# EAGLE schematic 9.1.2.1_detector (EAGLE 9.6.2)
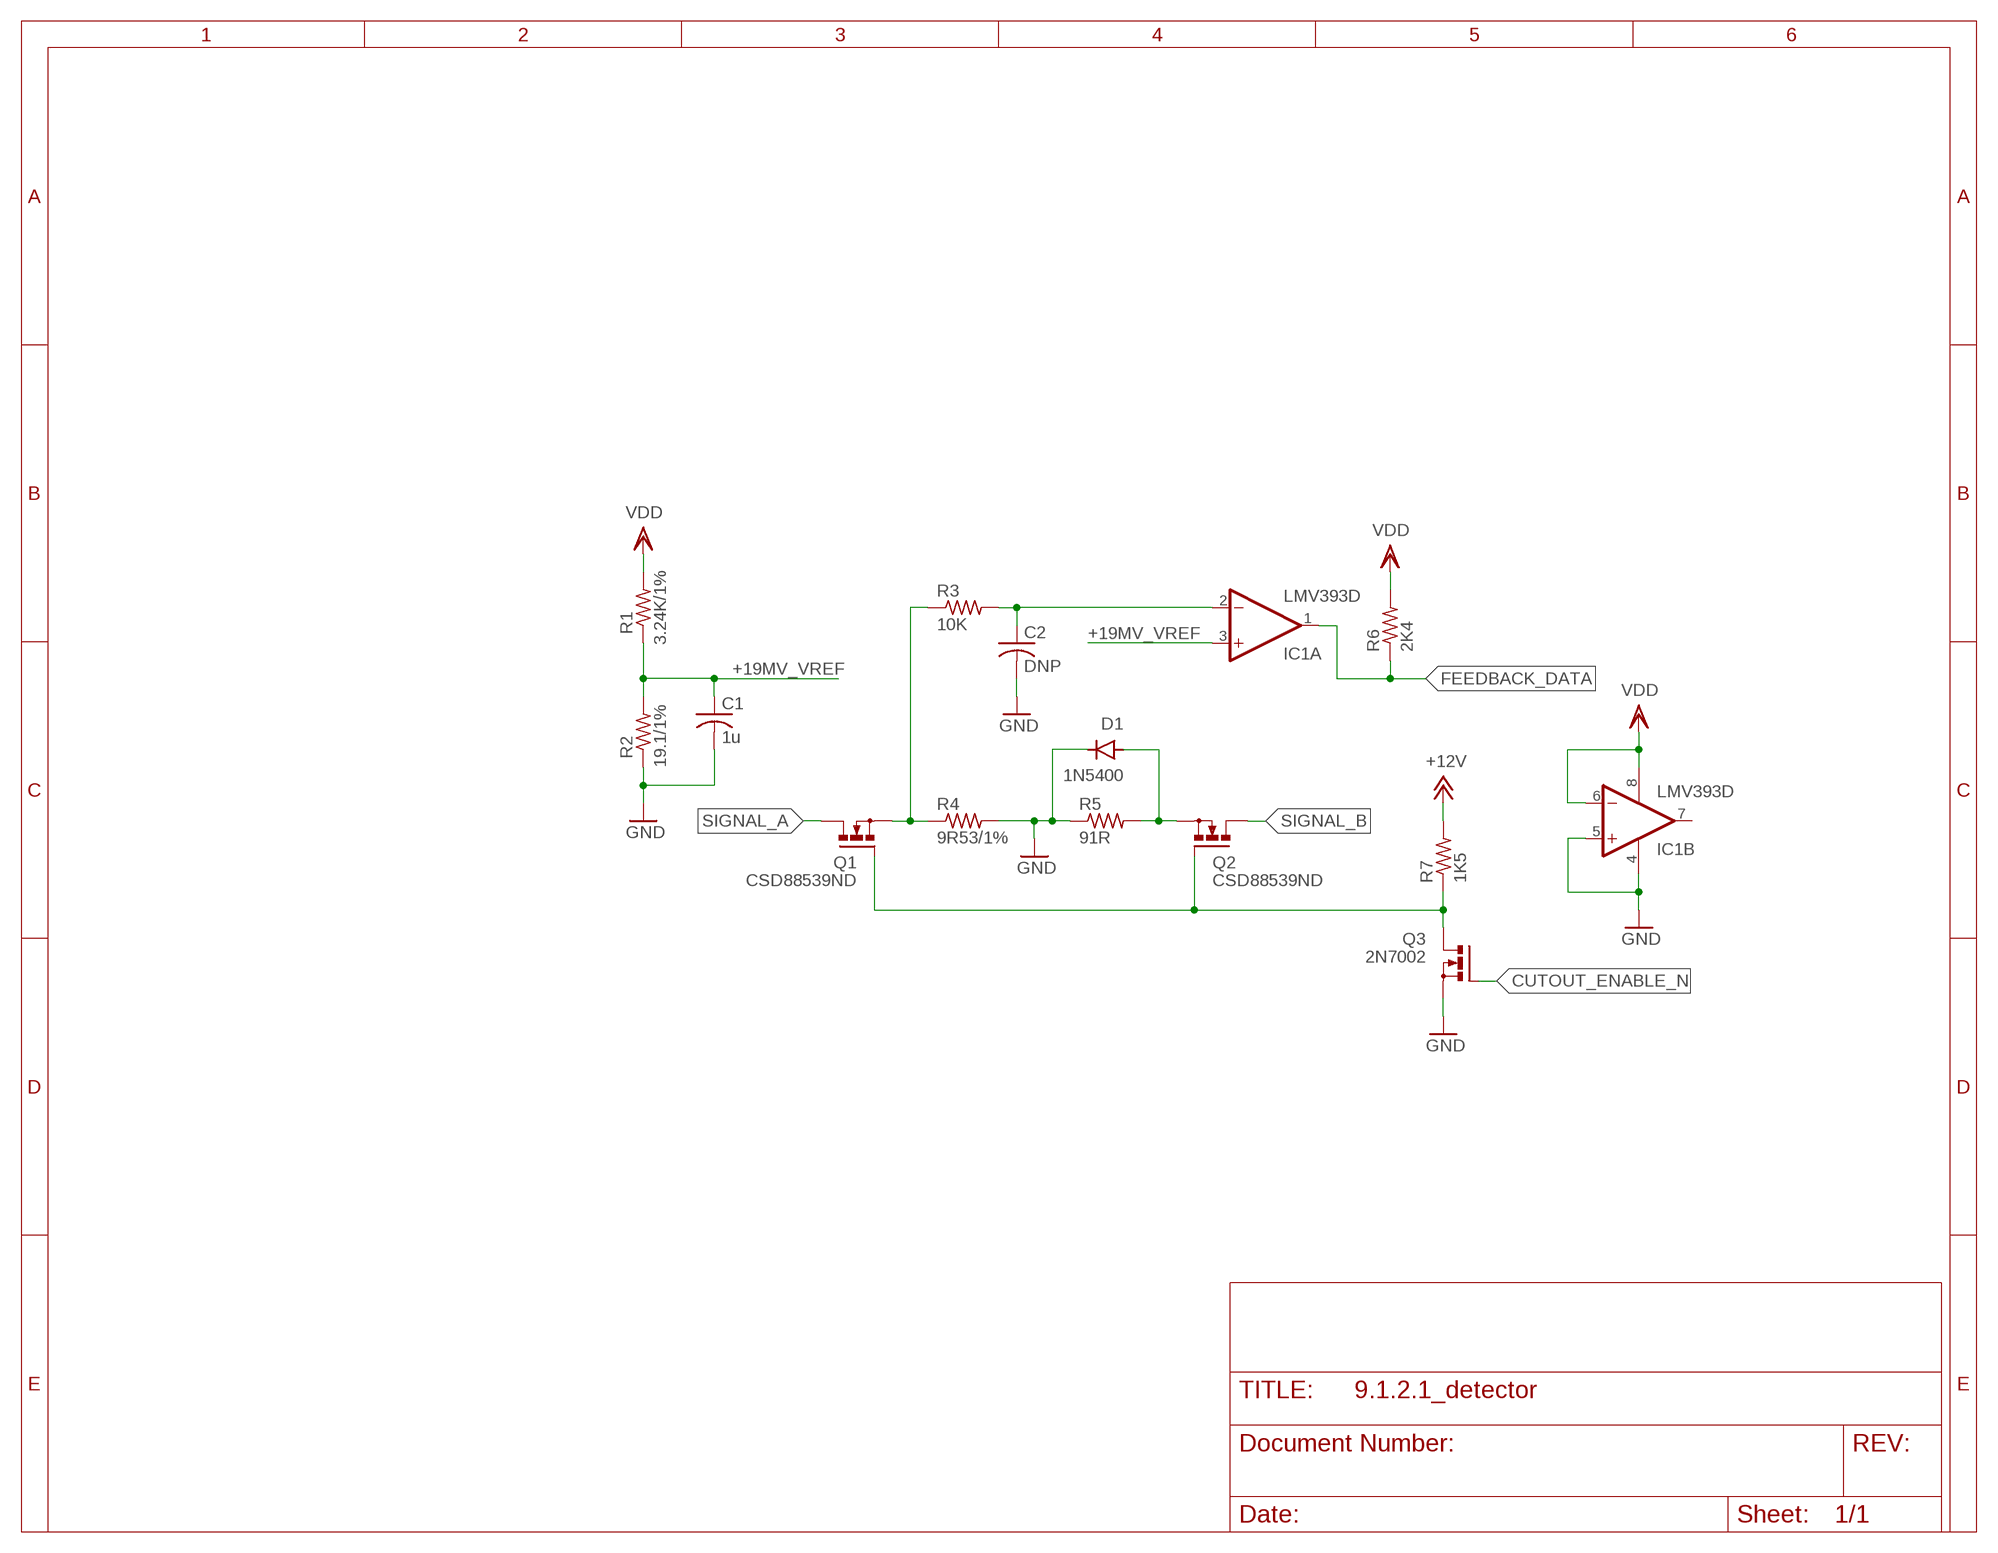
[diagram p0: schematic, sheet 1]

## Parts
C1  1u  C-USC0402  [C0402]
C2  DNP  C-USC0402  [C0402]
D1  1N5400  [DO201-15]
IC1  LMV393D  LM393D  [SO08]
Q1  CSD88539ND  IRF512  [TO220BV]
Q2  CSD88539ND  IRF512  [TO220BV]
Q3  2N7002  IRF512  [TO220BV]
R1  3.24K/1%  R-US_R0402  [R0402]
R2  19.1/1%  R-US_R0402  [R0402]
R3  10K  R-US_R0402  [R0402]
R4  9R53/1%  R-US_R1206  [R1206]
R5  91R  R-US_R1206  [R1206]
R6  2K4  R-US_R0402  [R0402]
R7  1K5  R-US_R1206  [R1206]

## Nets
+12V: R7.2
+19MV_VREF: C1.1 IC1.3(A:+IN) R1.1 R2.2
CUTOUT_ENABLE_N: Q3.G
FEEDBACK_DATA: IC1.1(A:OUT) R6.1
GND: C1.2 C2.2 D1.C IC1.4(P:V-) IC1.5(B:+IN) Q3.S R2.1 R4.2 R5.1
N$1: Q1.G Q2.G Q3.D R7.1
N$3: D1.A Q2.S R5.2
N$5: C2.1 IC1.2(A:-IN) R3.2
N$7: Q1.S R3.1 R4.1
SIGNAL_A: Q1.D
SIGNAL_B: Q2.D
VDD: IC1.6(B:-IN) IC1.8(P:V+) R1.2 R6.2
Unconnected: IC1.7(B:OUT)

## Library data of the parts
C1 C2 = rcl:C-US: CAPACITOR, American symbol; SPICEPREFIX: C
D1 = diode:1N5400: DIODE standard rectifier, 3 A, 50 V (Motorola)
IC1 = linear:LM393: COMPARATOR
Q1-Q3 = transistor-power:IRF512: N-CHANNEL MOS FET
R1-R7 = resistor:R-US_: RESISTOR, American symbol